# Altium schematic sheet MUX.SchDoc: MUX
size 420 x 297 mm; DocumentNumber: 4; SheetNumber: 4; SheetTotal: 8
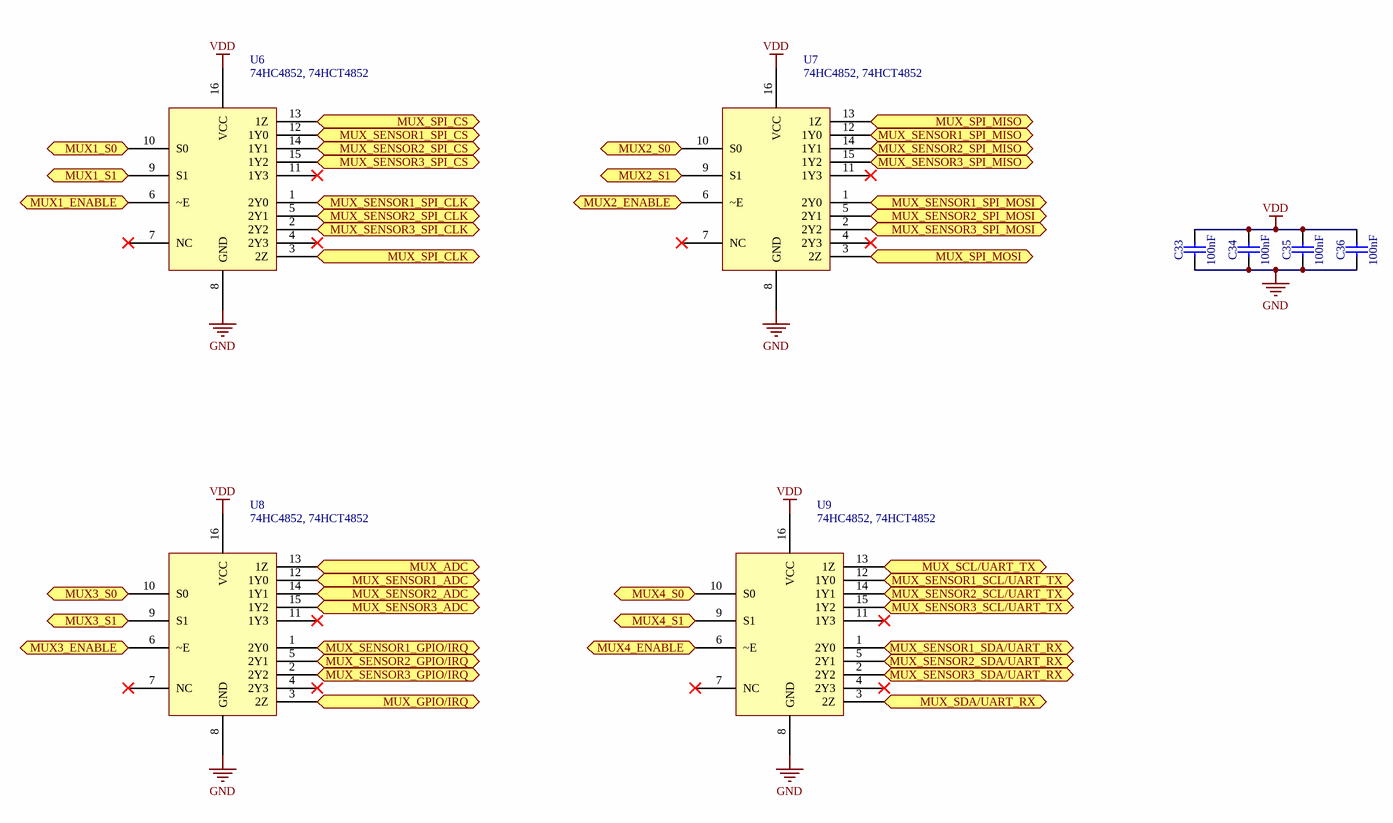
[diagram p0: MUX.SchDoc]

## Parts
C33  100nF  [CAPC1608X87N]
C34  100nF  [CAPC1608X87N]
C35  100nF  [CAPC1608X87N]
C36  100nF  [CAPC1608X87N]
U6  74HC4852, 74HCT4852  [TSSOP16]
U7  74HC4852, 74HCT4852  [TSSOP16]
U8  74HC4852, 74HCT4852  [TSSOP16]
U9  74HC4852, 74HCT4852  [TSSOP16]

## Ports
MUX1_ENABLE (in), MUX1_S0 (in), MUX1_S1 (in), MUX2_ENABLE (in), MUX2_S0 (in), MUX2_S1 (in), MUX3_ENABLE (in), MUX3_S0 (in), MUX3_S1 (in), MUX4_ENABLE (in), MUX4_S0 (in), MUX4_S1 (in), MUX_ADC (out), MUX_GPIO/IRQ (bidir), MUX_SCL/UART_TX (bidir), MUX_SDA/UART_RX (bidir), MUX_SENSOR1_ADC (in), MUX_SENSOR1_GPIO/IRQ (bidir), MUX_SENSOR1_SCL/UART_TX (bidir), MUX_SENSOR1_SDA/UART_RX (bidir), MUX_SENSOR1_SPI_CLK (bidir), MUX_SENSOR1_SPI_CS (bidir), MUX_SENSOR1_SPI_MISO (bidir), MUX_SENSOR1_SPI_MOSI (bidir), MUX_SENSOR2_ADC (in), MUX_SENSOR2_GPIO/IRQ (bidir), MUX_SENSOR2_SCL/UART_TX (bidir), MUX_SENSOR2_SDA/UART_RX (bidir), MUX_SENSOR2_SPI_CLK (bidir), MUX_SENSOR2_SPI_CS (bidir), MUX_SENSOR2_SPI_MISO (bidir), MUX_SENSOR2_SPI_MOSI (bidir), MUX_SENSOR3_ADC (in), MUX_SENSOR3_GPIO/IRQ (bidir), MUX_SENSOR3_SCL/UART_TX (bidir), MUX_SENSOR3_SDA/UART_RX (bidir), MUX_SENSOR3_SPI_CLK (bidir), MUX_SENSOR3_SPI_CS (bidir), MUX_SENSOR3_SPI_MISO (bidir), MUX_SENSOR3_SPI_MOSI (bidir), MUX_SPI_CLK (bidir), MUX_SPI_CS (bidir), MUX_SPI_MISO (bidir), MUX_SPI_MOSI (bidir)

## Nets
GND: C33.1 C34.1 C35.1 C36.1 U6.8(GND) U7.8(GND) U8.8(GND) U9.8(GND)
VDD: C33.2 C34.2 C35.2 C36.2 U6.16(VCC) U7.16(VCC) U8.16(VCC) U9.16(VCC)
MUX1_ENABLE: U6.6(~E) ; port MUX1_ENABLE
MUX1_S0: U6.10(S0) ; port MUX1_S0
MUX1_S1: U6.9(S1) ; port MUX1_S1
MUX2_ENABLE: U7.6(~E) ; port MUX2_ENABLE
MUX2_S0: U7.10(S0) ; port MUX2_S0
MUX2_S1: U7.9(S1) ; port MUX2_S1
MUX3_ENABLE: U8.6(~E) ; port MUX3_ENABLE
MUX3_S0: U8.10(S0) ; port MUX3_S0
MUX3_S1: U8.9(S1) ; port MUX3_S1
MUX4_ENABLE: U9.6(~E) ; port MUX4_ENABLE
MUX4_S0: U9.10(S0) ; port MUX4_S0
MUX4_S1: U9.9(S1) ; port MUX4_S1
MUX_ADC: U8.13(1Z) ; port MUX_ADC
MUX_GPIO/IRQ: U8.3(2Z) ; port MUX_GPIO/IRQ
MUX_SCL/UART_TX: U9.13(1Z) ; port MUX_SCL/UART_TX
MUX_SDA/UART_RX: U9.3(2Z) ; port MUX_SDA/UART_RX
MUX_SENSOR1_ADC: U8.12(1Y0) ; port MUX_SENSOR1_ADC
MUX_SENSOR1_GPIO/IRQ: U8.1(2Y0) ; port MUX_SENSOR1_GPIO/IRQ
MUX_SENSOR1_SCL/UART_TX: U9.12(1Y0) ; port MUX_SENSOR1_SCL/UART_TX
MUX_SENSOR1_SDA/UART_RX: U9.1(2Y0) ; port MUX_SENSOR1_SDA/UART_RX
MUX_SENSOR1_SPI_CLK: U6.1(2Y0) ; port MUX_SENSOR1_SPI_CLK
MUX_SENSOR1_SPI_CS: U6.12(1Y0) ; port MUX_SENSOR1_SPI_CS
MUX_SENSOR1_SPI_MISO: U7.12(1Y0) ; port MUX_SENSOR1_SPI_MISO
MUX_SENSOR1_SPI_MOSI: U7.1(2Y0) ; port MUX_SENSOR1_SPI_MOSI
MUX_SENSOR2_ADC: U8.14(1Y1) ; port MUX_SENSOR2_ADC
MUX_SENSOR2_GPIO/IRQ: U8.5(2Y1) ; port MUX_SENSOR2_GPIO/IRQ
MUX_SENSOR2_SCL/UART_TX: U9.14(1Y1) ; port MUX_SENSOR2_SCL/UART_TX
MUX_SENSOR2_SDA/UART_RX: U9.5(2Y1) ; port MUX_SENSOR2_SDA/UART_RX
MUX_SENSOR2_SPI_CLK: U6.5(2Y1) ; port MUX_SENSOR2_SPI_CLK
MUX_SENSOR2_SPI_CS: U6.14(1Y1) ; port MUX_SENSOR2_SPI_CS
MUX_SENSOR2_SPI_MISO: U7.14(1Y1) ; port MUX_SENSOR2_SPI_MISO
MUX_SENSOR2_SPI_MOSI: U7.5(2Y1) ; port MUX_SENSOR2_SPI_MOSI
MUX_SENSOR3_ADC: U8.15(1Y2) ; port MUX_SENSOR3_ADC
MUX_SENSOR3_GPIO/IRQ: U8.2(2Y2) ; port MUX_SENSOR3_GPIO/IRQ
MUX_SENSOR3_SCL/UART_TX: U9.15(1Y2) ; port MUX_SENSOR3_SCL/UART_TX
MUX_SENSOR3_SDA/UART_RX: U9.2(2Y2) ; port MUX_SENSOR3_SDA/UART_RX
MUX_SENSOR3_SPI_CLK: U6.2(2Y2) ; port MUX_SENSOR3_SPI_CLK
MUX_SENSOR3_SPI_CS: U6.15(1Y2) ; port MUX_SENSOR3_SPI_CS
MUX_SENSOR3_SPI_MISO: U7.15(1Y2) ; port MUX_SENSOR3_SPI_MISO
MUX_SENSOR3_SPI_MOSI: U7.2(2Y2) ; port MUX_SENSOR3_SPI_MOSI
MUX_SPI_CLK: U6.3(2Z) ; port MUX_SPI_CLK
MUX_SPI_CS: U6.13(1Z) ; port MUX_SPI_CS
MUX_SPI_MISO: U7.13(1Z) ; port MUX_SPI_MISO
MUX_SPI_MOSI: U7.3(2Z) ; port MUX_SPI_MOSI

Not connected (* = marked no-connect by the designer): U6 4(2Y3)* 7(NC)* 11(1Y3)*; U7 4(2Y3)* 7(NC)* 11(1Y3)*; U8 4(2Y3)* 7(NC)* 11(1Y3)*; U9 4(2Y3)* 7(NC)* 11(1Y3)*

## Notes on the sheet
- Project/Equipment
- Document
- Sensorbox
- Designer
- Drawn by
- Check.by
- Copyright Creotech Instruments SA 2014.
  This documentation describes Open Hardware and is licensed under the CERN OHL v.1.1. You may redistribute and modify this documentation under the terms of the CERN OHL v.1.1. (http://ohwr.org/CERNOHL). This documentation is distributed WITHOUT ANY EXPRESS OR IMPLIED WARRANTY, INCLUDING OF MERCHANTABILITY, SATISFACTORY QUALITY AND FITNESS FOR A PARTICULAR PURPOSE. Please see the CERN OHL v.1.1 for applicable conditions.
- CTI
- Creotech Instruments S.A.
- File
- Last Mod.
- Print Date
- Sheet
- Size
- A3
- of
- Rev

## Library data of the parts
C33-C36 = CC0603_100NF_50V_10%_X7R: Non-polarised capacitor; Part Description: SMD Multilayer Chip Ceramic Capacitor; Manufacturer: GENERIC; Manufacturer1 Part Number: 223858615649; Voltage: 50V; TC: X7R; Tolerance: ±10%; Table: Capacitors SMD; Part Number: CC0603_100NF_50V_10%_X7R; Component Kind: Standard; Component Type: Standard; Pin Count: 2; Value: 100nF; Status: Preferred; Manufacturer Part Number: CC0603_100NF_50V_10%_X7R; Case: 0603; Mounted: Yes; Socket: No; SMD: Yes; Manufacturer1 Example: PHYCOMP; Manufacturer1 ComponentHeight: 0.87mm; HelpURL: \\cern.ch\dfs\Applications\Altium\Datasheets\CC0603_X7R_PHYCOMP.pdf; Author: CERN DEM JLC; CreateDate: 2007-12-03; LatestRevisionDate: 2007-12-03
U6-U9 = 74HC4852, 74HCT4852: NXP Analog Multiplexer/Demultiplexer